# Altium project PCB_Project_EPM.PrjPcb
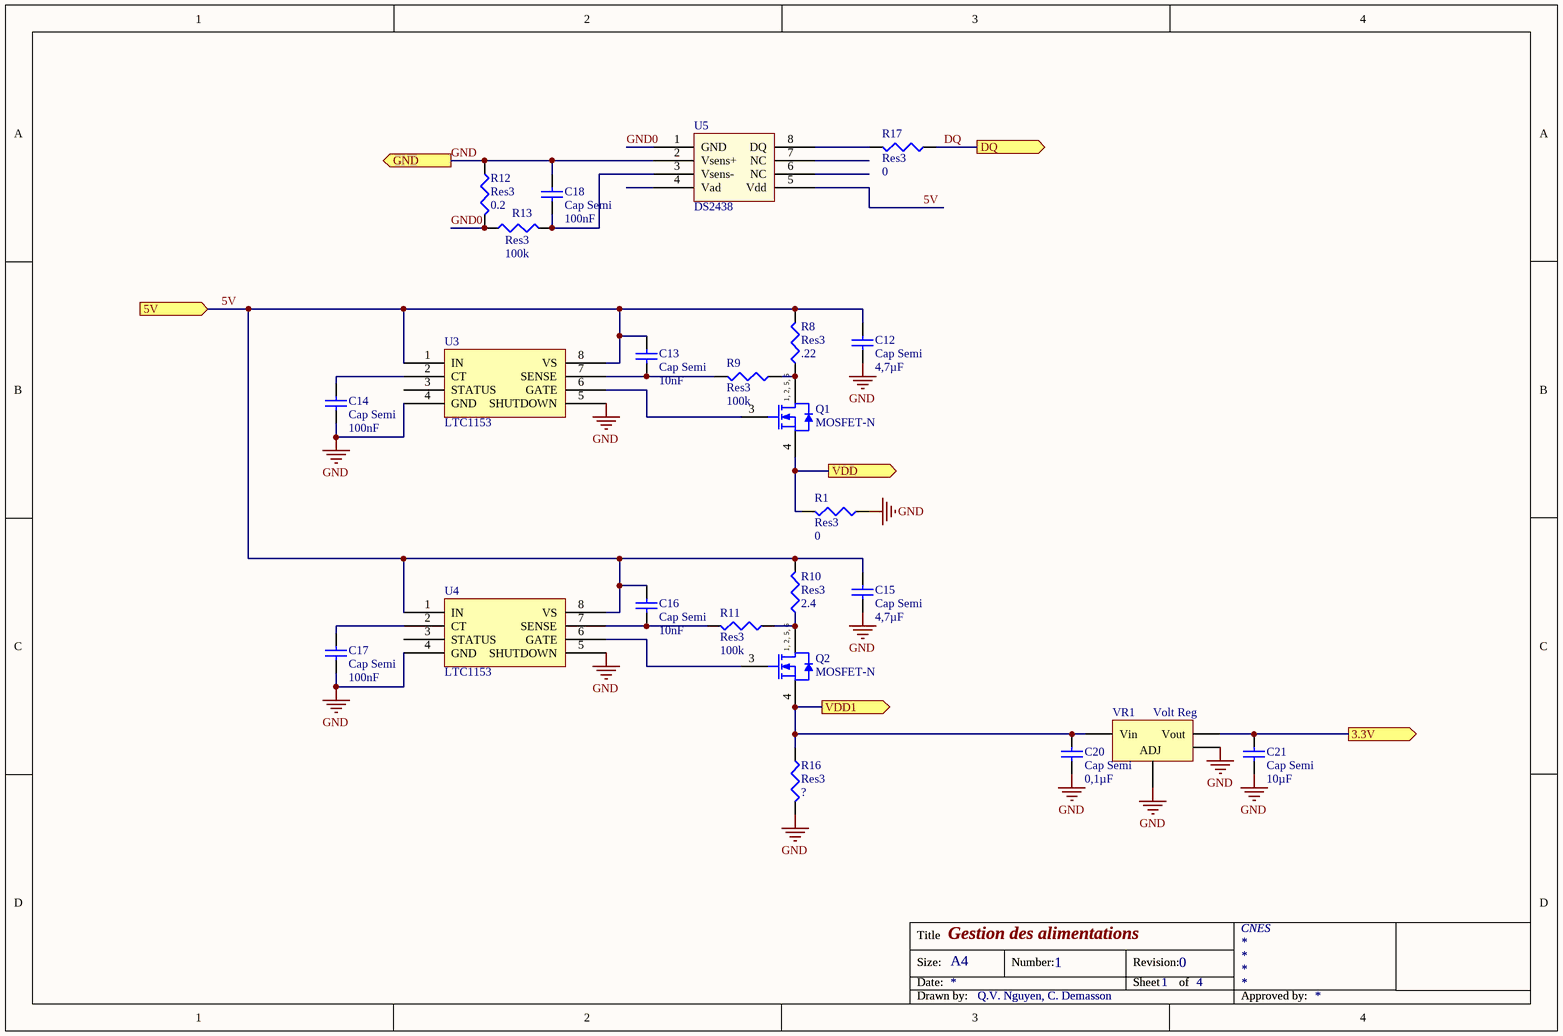
[diagram p0: sch_alim.SchDoc]
4 sheets, 53 parts. Net scope: hierarchical (ports join the sheet entries above them; power ports are global).
Board file: PCB_EPM.PcbDoc
Sheets:
  sch_alim.SchDoc
  sch_epm.SchDoc
    Pilote du Moteur = sch_driver.SchDoc
    Microcontrôleur PSoC 4 = sch_psoc.SchDoc

## Sheet sch_alim.SchDoc: Gestion des alimentations
size A4; CheckedBy: Q.V. Nguyen; Author: Q.V. Nguyen, C. Demasson; DrawnBy: Q.V. Nguyen, C. Demasson; Organization: CNES; DocumentNumber: 1; Revision: 0; SheetNumber: 1; SheetTotal: 4

### Parts
C12  Cap Semi  value 4,7µF  [C1206]
C13  Cap Semi  value 10nF  [C1206]
C14  Cap Semi  value 100nF  [C1206]
C15  Cap Semi  value 4,7µF  [C1206]
C16  Cap Semi  value 10nF  [C1206]
C17  Cap Semi  value 100nF  [C1206]
C18  Cap Semi  value 100nF  [C1206]
C20  Cap Semi  value 0,1µF  [C1206]
C21  Cap Semi  value 10µF  [C1206]
Q1  MOSFET-N  [ONSC-SC70-6-419B-02_V]
Q2  MOSFET-N  [ONSC-SC70-6-419B-02_V]
R1  Res3  value 0  [C1206]
R8  Res3  value .22  [C1206]
R9  Res3  value 100k  [C1206]
R10  Res3  value 2.4  [C1206]
R11  Res3  value 100k  [C1206]
R12  Res3  value 0.2  [C1206]
R13  Res3  value 100k  [C1206]
R16  Res3  [C1206]
R17  Res3  value 0  [C1206]
U3  LTC1153  [S8 Package]
U4  LTC1153  [S8 Package]
U5  DS2438  [SO8_N]
VR1  Volt Reg  [Reg_LM317]

### Ports
3.3V (out), 5V (in), DQ (out), GND (out), VDD1 (out), VDD (out)

### Nets
GND: C12.2 C14.2 C15.2 C17.2 C18.1 C20.2 C21.2 R1.1 R12.1 R16.2 U3.4(GND) U3.5(SHUTDOWN) U4.4(GND) U4.5(SHUTDOWN) U5.2(Vsens+) VR1.2(ADJ) VR1.4(Vout) ; port GND
5V: C12.1 C13.1 C15.1 C16.1 R8.2 R10.2 U3.1(IN) U3.8(VS) U4.1(IN) U4.8(VS) U5.5(Vdd) ; port 5V
DQ: R17.1 ; port DQ
GND0: R12.2 R13.1 U5.1(GND)
NetC13_2: C13.2 R9.2 U3.7(SENSE)
NetC14_1: C14.1 U3.2(CT)
NetC16_2: C16.2 R11.2 U4.7(SENSE)
NetC17_1: C17.1 U4.2(CT)
NetC18_2: C18.2 R13.2 U5.3(Vsens-)
NetC20_1: C20.1 Q2.4(S) R16.1 VR1.1(Vin) ; port VDD1
NetC21_1: C21.1 VR1.3(Vout) ; port 3.3V
NetQ1_1: Q1.1(D) Q1.2(D) Q1.5(D) Q1.6(D) R8.1 R9.1
NetQ1_3: Q1.3(G) U3.6(GATE)
NetQ1_4: Q1.4(S) R1.2 ; port VDD
NetQ2_1: Q2.1(D) Q2.2(D) Q2.5(D) Q2.6(D) R10.1 R11.1
NetQ2_3: Q2.3(G) U4.6(GATE)
NetR17_2: R17.2 U5.8(DQ)

Not connected (* = marked no-connect by the designer): U3 3(STATUS); U4 3(STATUS); U5 4(Vad) 6(NC) 7(NC)

### Notes on the sheet
- Title
- Size:
- Date:
- A4
- Number:
- Revision:
- Sheet
- of
- Drawn by:
- Approved by:
- (in symbol CMP-1058-00626-1) 1, 2, 5, 6

### Library data of the parts
C12-C18 C20 C21 = Cap Semi: Capacitor (Semiconductor SIM Model); Published: 8-Jun-2000; LatestRevisionDate: 29-May-2009; LatestRevisionNote: IPC-7351 Footprint Added.; PackageReference: C1206; Publisher: Altium Limited; PackageDescription: Chip Capacitor
Q1 Q2 = CMP-1058-00626-1: Trench Power MOSFET, 20 V, 4 A, Single N-Channel, 6-Pin SC70, Pb-Free, Tape and Reel; PartNumber: NTJS3157NT2G; Manufacturer: On Semiconductor; Qrr Typ (nC): 5; Channel Polarity: N Channel; Crss Typ (pF): 60; VGS Max (V): 8; V(BR)DSS Min (V): 20; Ciss Typ (pF): 500; Coss Typ (pF): 75; ID Max (A): 4; PD Max (W): 1; ComponentLink2Description: Datasheet; ComponentLink1URL: http://www.onsemi.com/; ComponentLink3Description: Package Specification; PackageVersion: Rev. Y, 12/2012; ComponentLink1Description: Manufacturer URL; RoHS: Pb-Free; PackageReference: SC70-6-419B-02; Mounting Technology: Surface Mount; Packing: Tape and Reel; DatasheetVersion: Rev. 3; PackageDescription: 6-Pin Small Outline Transistor, Body 2 x 1.25 mm, Pitch 0.65 mm; ComponentLink3URL: http://www.onsemi.com/pub_link/Collateral/419B-02.PDF; Package Type: SC-88-6 / SC-70-6 / SOT-363-6; Configuration: Single; VGS(th) Max (V): 1; ComponentLink2URL: http://www.onsemi.com/pub_link/Collateral/NTJS3157N-D.PDF
R1 R8-R13 R16 R17 = Res3: Resistor; Published: 8-Jun-2000; LatestRevisionDate: 29-May-2009; LatestRevisionNote: IPC-7351 Footprint Added.; PackageReference: J1-0603; Publisher: Altium Limited; PackageDescription: Chip Resistor
  R16: Value: ?
U5 = DS2438: Battery Monitor
VR1 = Volt Reg: Voltage Regulator; Published: 24-Mar-1999; LatestRevisionDate: 29-May-2009; LatestRevisionNote: IPC-7351 Footprint Added.; PackageReference: D2PAK; Publisher: Altium Limited; PackageDescription: 3-Pin Transistor Outline Package 2.54 mm Pitch, 15.1 mm Lead Span

## Sheet sch_epm.SchDoc: Electronique de Pilotage du Moteur
size A4; CheckedBy: Q.V. Nguyen; Author: Q.V. Nguyen, C. Demasson; DrawnBy: Q.V. Nguyen, C. Demasson; Organization: CNES; DocumentNumber: 1; Revision: 0; SheetNumber: 1; SheetTotal: 4
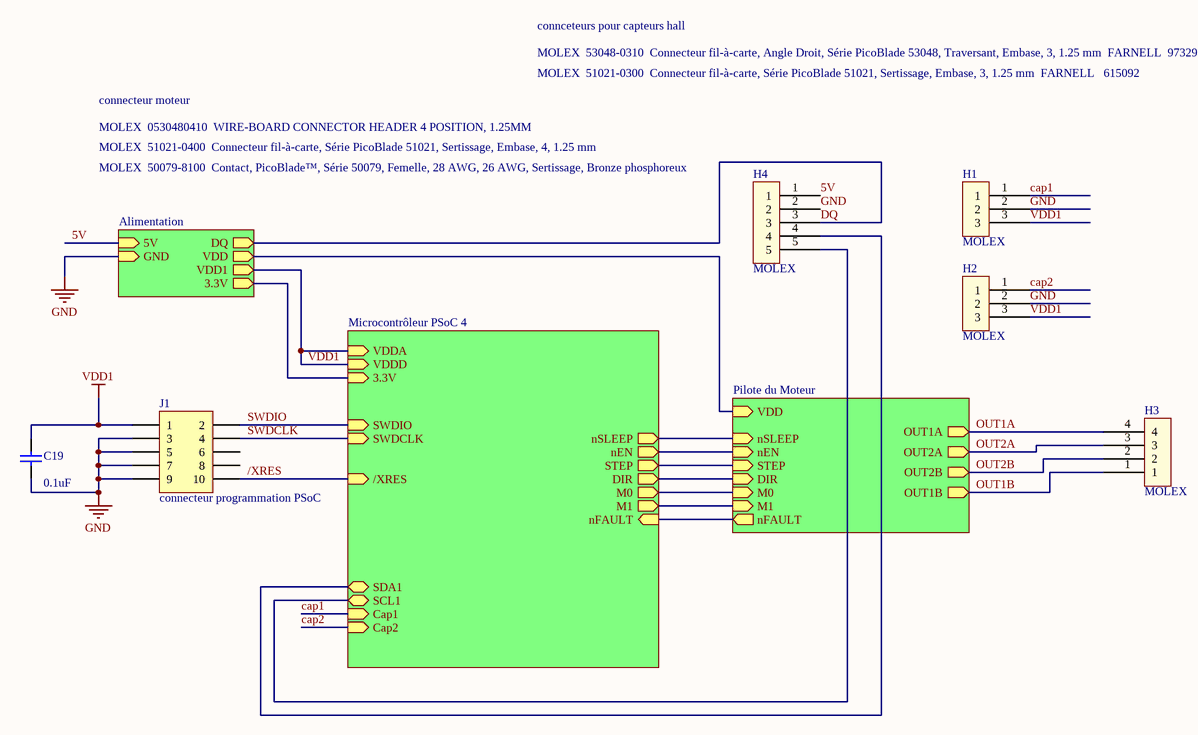
[diagram p1: sch_epm.SchDoc]

### Parts
C19  value 0.1uF  [C1206]
H1  MOLEX  [molex_male_3_broches]
H2  MOLEX  [molex_male_3_broches]
H3  MOLEX  [molex_male_4_broches]
H4  MOLEX  [molex_male_5_broches]
J1  connecteur programmation PSoC  [50MIL_KEYED_SMD]

### Sub-sheets
Alimentation = sch_alim2.0.SchDoc (file not in this document): 5V (in), DQ (out), GND (in), VDD (out), VDD1 (out), 3.3V (out)
Microcontrôleur PSoC 4 = sch_psoc.SchDoc: SWDIO (in), SWDCLK (in), /XRES (in), Cap1 (in), Cap2 (in), M0 (out), DIR (out), STEP (out), nEN (out), nSLEEP (out), nFAULT (in), M1 (out), VDDA (in), VDDD (in), 3.3V (in), SDA1, SCL1
Pilote du Moteur = sch_driver.SchDoc: OUT1A (out), OUT2A (out), OUT2B (out), VDD (in), nSLEEP (in), nEN (in), STEP (in), DIR (in), M0 (in), M1 (in), nFAULT (out), OUT1B (out)

### Nets
GND: C19.1 H1.2 H2.2 H4.2 J1.3 J1.5 J1.7 J1.9 ; sheet Alimentation/GND
VDD1: C19.2 H1.3 H2.3 J1.1 ; sheet Alimentation/VDD1, sheet Microcontrôleur PSoC 4/VDDA, sheet Microcontrôleur PSoC 4/VDDD
3.3V: sheet Alimentation/3.3V, sheet Microcontrôleur PSoC 4/3.3V
5V: H4.1 ; sheet Alimentation/5V
/XRES: J1.10 ; sheet Microcontrôleur PSoC 4//XRES
cap1: H1.1 ; sheet Microcontrôleur PSoC 4/Cap1
cap2: H2.1 ; sheet Microcontrôleur PSoC 4/Cap2
DIR: sheet Pilote du Moteur/DIR, sheet Microcontrôleur PSoC 4/DIR
DQ: H4.3 ; sheet Alimentation/DQ
M0: sheet Pilote du Moteur/M0, sheet Microcontrôleur PSoC 4/M0
M1: sheet Pilote du Moteur/M1, sheet Microcontrôleur PSoC 4/M1
nEN: sheet Pilote du Moteur/nEN, sheet Microcontrôleur PSoC 4/nEN
nFAULT: sheet Pilote du Moteur/nFAULT, sheet Microcontrôleur PSoC 4/nFAULT
nSLEEP: sheet Pilote du Moteur/nSLEEP, sheet Microcontrôleur PSoC 4/nSLEEP
OUT1A: H3.4 ; sheet Pilote du Moteur/OUT1A
OUT1B: H3.1 ; sheet Pilote du Moteur/OUT1B
OUT2A: H3.3 ; sheet Pilote du Moteur/OUT2A
OUT2B: H3.2 ; sheet Pilote du Moteur/OUT2B
SCL1: H4.5 ; sheet Microcontrôleur PSoC 4/SCL1
SDA1: H4.4 ; sheet Microcontrôleur PSoC 4/SDA1
STEP: sheet Pilote du Moteur/STEP, sheet Microcontrôleur PSoC 4/STEP
SWDCLK: J1.4 ; sheet Microcontrôleur PSoC 4/SWDCLK
SWDIO: J1.2 ; sheet Microcontrôleur PSoC 4/SWDIO
VDD: sheet Pilote du Moteur/VDD, sheet Alimentation/VDD

Not connected (* = marked no-connect by the designer): J1 6 8

### Notes on the sheet
- MOLEX  53048-0310  Connecteur fil-à-carte, Angle Droit, Série PicoBlade 53048, Traversant, Embase, 3, 1.25 mm  FARNELL  9732918
- MOLEX  51021-0300  Connecteur fil-à-carte, Série PicoBlade 51021, Sertissage, Embase, 3, 1.25 mm  FARNELL   615092
- connceteurs pour capteurs hall
- MOLEX  0530480410  WIRE-BOARD CONNECTOR HEADER 4 POSITION, 1.25MM
- connecteur moteur
- MOLEX  51021-0400  Connecteur fil-à-carte, Série PicoBlade 51021, Sertissage, Embase, 4, 1.25 mm
- (near H4) MOLEX  50079-8100  Contact, PicoBlade™, Série 50079, Femelle, 28 AWG, 26 AWG, Sertissage, Bronze phosphoreux
- Title
- Size:
- Date:
- A4
- Number:
- Revision:
- Sheet
- of
- Drawn by:
- Approved by:

### Library data of the parts
C19 = Cap Semi: Capacitor (Semiconductor SIM Model); Published: 8-Jun-2000; LatestRevisionDate: 29-May-2009; LatestRevisionNote: IPC-7351 Footprint Added.; PackageReference: C1206; Publisher: Altium Limited; PackageDescription: Chip Capacitor
H1 H2 = Molex Male 3 broches: MOLEX-53048-0510_FARNELL_9732918
H3 = Molex Male 4 broches_1: MOLEX-53048-0510_FARNELL_2064326
H4 = Molex Male 5 broches: MOLEX-53048-0510_FARNELL_2064326
J1 = Header 5X2: Header, 5-Pin, Dual row; LatestRevisionDate: 17-Jul-2002; LatestRevisionNote: Re-released for DXP Platform.; Publisher: Altium Limited

## Sheet sch_driver.SchDoc: Pilote du Moteur
size A4; CheckedBy: Q.V. Nguyen; Author: Q.V. Nguyen, C. Demasson; DrawnBy: Q.V. Nguyen, C. Demasson; Organization: CNES; DocumentNumber: 1; Revision: 0; SheetNumber: 4; SheetTotal: 4; ProjectName: EYE-SAT
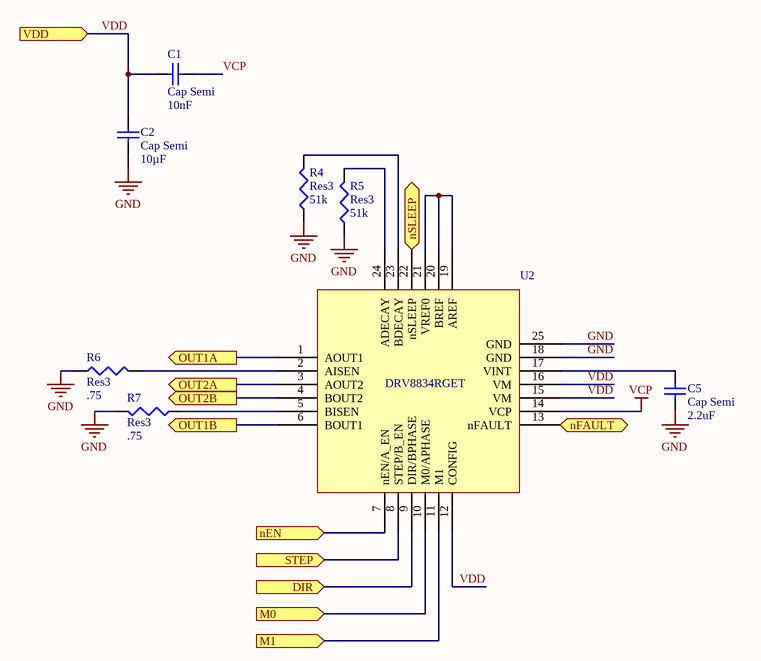
[diagram p2: sch_driver.SchDoc]

### Parts
C1  Cap Semi  value 10nF  [C1206]
C2  Cap Semi  value 10µF  [C1206]
C5  Cap Semi  value 2.2uF  [C1206]
R4  Res3  value 51k  [C1206]
R5  Res3  value 51k  [C1206]
R6  Res3  value .75  [C1206]
R7  Res3  value .75  [C1206]
U2  DRV8834RGET  [QFN24]

### Ports
DIR (in), M0 (in), M1 (in), nEN (in), nFAULT (out), nSLEEP (in), OUT1A (out), OUT1B (out), OUT2A (out), OUT2B (out), STEP (in), VDD (in)

### Nets
GND: C2.2 C5.1 R4.1 R5.1 R6.1 R7.2 U2.18(GND) U2.25(GND)
VCP: C1.1 U2.14(VCP)
DIR: U2.9(DIR/BPHASE) ; port DIR
M0: U2.10(M0/APHASE) ; port M0
M1: U2.11(M1) ; port M1
nEN: U2.7(nEN/A_EN) ; port nEN
nFAULT: U2.13(nFAULT) ; port nFAULT
nSLEEP: U2.22(nSLEEP) ; port nSLEEP
OUT1A: U2.1(AOUT1) ; port OUT1A
OUT1B: U2.6(BOUT1) ; port OUT1B
OUT2A: U2.3(AOUT2) ; port OUT2A
OUT2B: U2.4(BOUT2) ; port OUT2B
STEP: U2.8(STEP/B_EN) ; port STEP
VDD: C1.2 C2.1 U2.12(CONFIG) U2.15(VM) U2.16(VM) ; port VDD
NetC5_2: C5.2 U2.17(VINT)
NetR4_2: R4.2 U2.23(BDECAY)
NetR5_2: R5.2 U2.24(ADECAY)
NetR6_2: R6.2 U2.2(AISEN)
NetR7_1: R7.1 U2.5(BISEN)
NetU2_19: U2.19(AREF) U2.20(BREF) U2.21(VREF0)

### Notes on the sheet
- Title
- Size:
- Date:
- A4
- Number:
- Revision:
- Sheet
- of
- Drawn by:
- Approved by:

### Library data of the parts
C1 C2 C5 = Cap Semi: Capacitor (Semiconductor SIM Model); Published: 8-Jun-2000; LatestRevisionDate: 29-May-2009; LatestRevisionNote: IPC-7351 Footprint Added.; PackageReference: C1206; Publisher: Altium Limited; PackageDescription: Chip Capacitor
R4-R7 = Res3: Resistor; Published: 8-Jun-2000; LatestRevisionDate: 29-May-2009; LatestRevisionNote: IPC-7351 Footprint Added.; PackageReference: J1-0603; Publisher: Altium Limited; PackageDescription: Chip Resistor

## Sheet sch_psoc.SchDoc: Microcontrôleur PSoC 4
size A4; CheckedBy: Q.V. Nguyen; Author: Q.V. Nguyen, C. Demasson; DrawnBy: Q.V. Nguyen, C. Demasson; Organization: CNES; Revision: 0; SheetNumber: 3; SheetTotal: 4; ProjectName: EYE-SAT
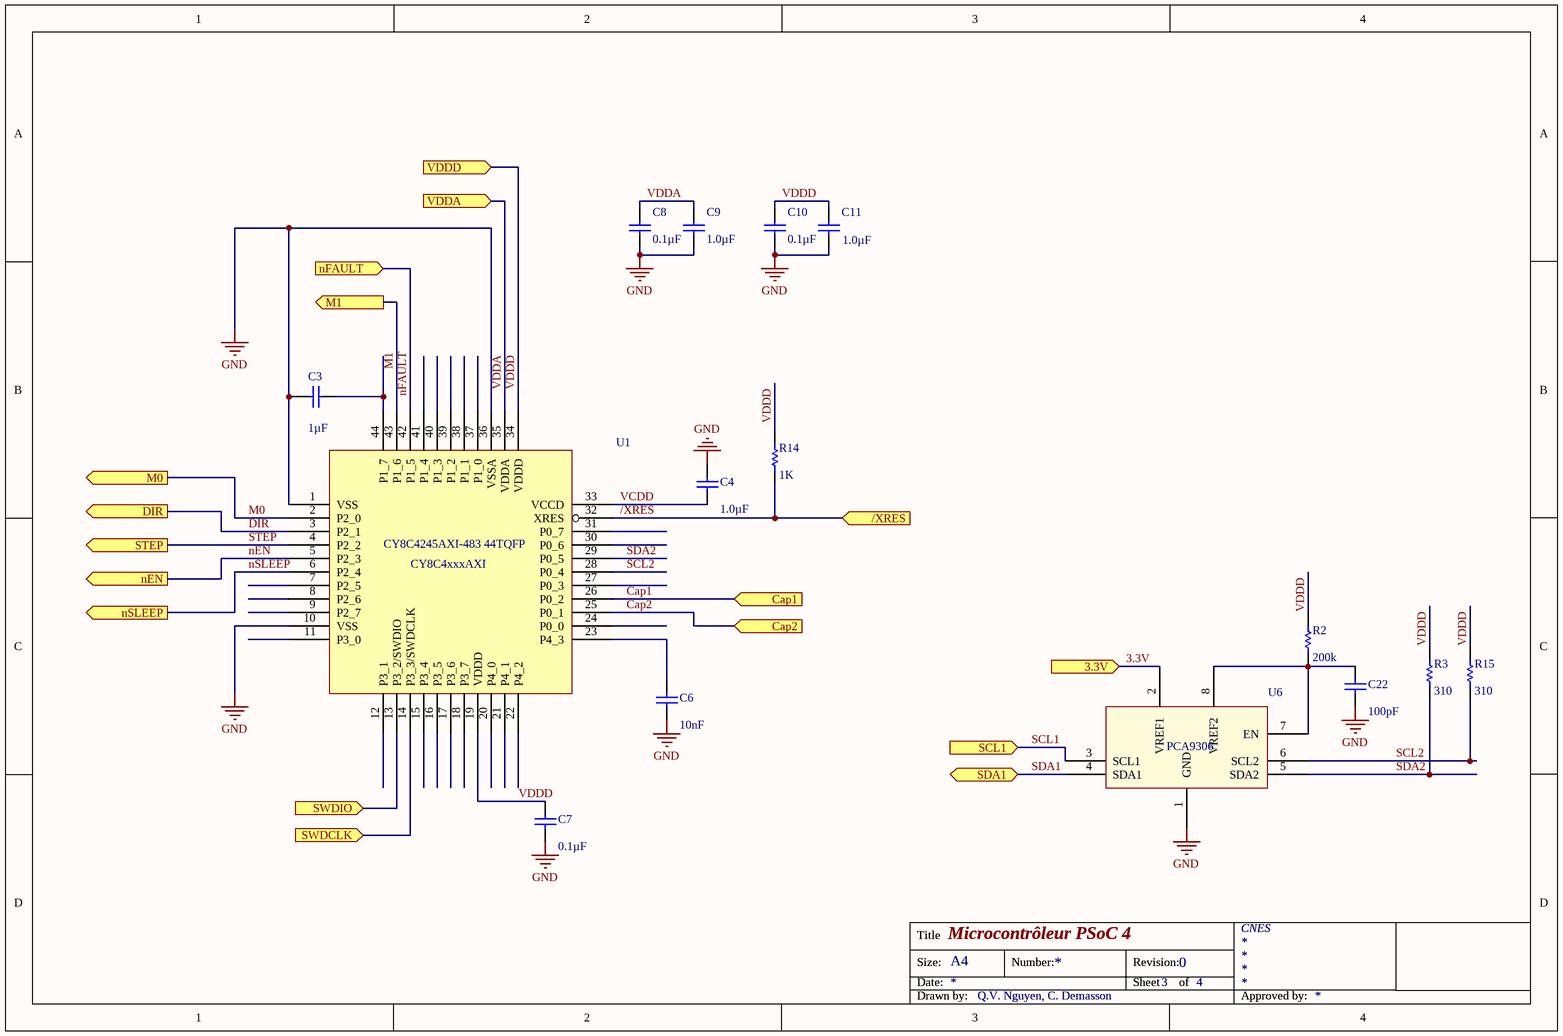
[diagram p3: sch_psoc.SchDoc]

### Parts
C3  value 1µF  [C1206]
C4  value 1.0µF  [C1206]
C6  value 10nF  [C1206]
C7  value 0.1µF  [C1206]
C8  value 0.1µF  [C1206]
C9  value 1.0µF  [C1206]
C10  value 0.1µF  [C1206]
C11  value 1.0µF  [C1206]
C22  value 100pF  [C1206]
R2  value 200k  [C1206]  (hidden comment: R2)
R3  value 310  [C1206]
R14  value 1K  [C1206]
R15  value 310  [C1206]
U1  CY8C4245AXI-483 44TQFP  [CY8C4xxxAXI]
U6  PCA9306  [VSSOP8]

### Ports
3.3V (in), /XRES (in), Cap1 (in), Cap2 (in), DIR (out), M0 (out), M1 (out), nEN (out), nFAULT (in), nSLEEP (out), SCL1 (in), SDA1 (bidir), STEP (out), SWDCLK (in), SWDIO (in), VDDA (in), VDDD (in)

### Nets
GND: C3.2 C4.1 C6.1 C7.1 C8.1 C9.1 C10.1 C11.1 C22.1 U1.1(VSS) U1.10(VSS) U1.36(VSSA) U6.1(GND)
VDDA: C7.2 C8.2 C9.2 C10.2 C11.2 R2.2 R3.2 R14.2 R15.2 U1.19(VDDD) U1.34(VDDD) U1.35(VDDA) ; port VDDA, port VDDD  [also labelled VDDD]  [project net VDD1]
3.3V: U6.2(VREF1) ; port 3.3V
/XRES: R14.1 U1.32(XRES) ; port /XRES
cap1: U1.26(P0_2) ; port Cap1
cap2: U1.25(P0_1) ; port Cap2
DIR: U1.3(P2_1) ; port DIR
M0: U1.2(P2_0) ; port M0
M1: U1.43(P1_6) ; port M1
nEN: U1.5(P2_3) ; port nEN
nFAULT: U1.42(P1_5) ; port nFAULT
nSLEEP: U1.6(P2_4) ; port nSLEEP
SCL1: U6.3(SCL1) ; port SCL1
SCL2: R15.1 U1.28(P0_4) U6.6(SCL2)
SDA1: U6.4(SDA1) ; port SDA1
SDA2: R3.1 U1.29(P0_5) U6.5(SDA2)
STEP: U1.4(P2_2) ; port STEP
SWDCLK: U1.14(P3_3/SWDCLK) ; port SWDCLK
SWDIO: U1.13(P3_2/SWDIO) ; port SWDIO
VCDD: C4.2 U1.33(VCCD)
NetC3_1: C3.1 U1.44(P1_7)
NetC6_2: C6.2 U1.23(P4_3)
NetC22_2: C22.2 R2.1 U6.7(EN) U6.8(VREF2)

Not connected (* = marked no-connect by the designer): U1 7(P2_5) 8(P2_6) 9(P2_7) 11(P3_0) 12(P3_1) 15(P3_4) 16(P3_5) 17(P3_6) 18(P3_7) 20(P4_0) 21(P4_1) 22(P4_2) 24(P0_0) 27(P0_3) 30(P0_6) 31(P0_7) 37(P1_0) 38(P1_1) 39(P1_2) 40(P1_3) 41(P1_4)

### Notes on the sheet
- Title
- Size:
- Date:
- A4
- Number:
- Revision:
- Sheet
- of
- Drawn by:
- Approved by:

### Library data of the parts
C3 C4 C6-C11 C22 = Cap Semi: Capacitor (Semiconductor SIM Model); Published: 8-Jun-2000; LatestRevisionDate: 29-May-2009; LatestRevisionNote: IPC-7351 Footprint Added.; PackageReference: C1206; Publisher: Altium Limited; PackageDescription: Chip Capacitor
R2 R3 R14 R15 = Res1: Resistor; Published: 8-Jun-2000; LatestRevisionDate: 17-Jul-2002; LatestRevisionNote: Re-released for DXP Platform.; PackageReference: AXIAL-0.3; Publisher: Altium Limited; PackageDescription: Axial Device, Thru-Hole; 2 Leads; 0.3 in Pin Spacing
U1 = CY8C4xxxAXI

## Nets that join several sheets
GND: sch_alim (17 pins), sch_epm (8 pins), sch_driver (8 pins), sch_psoc (13 pins)
VDD1: sch_epm (C19.2 H1.3 H2.3 J1.1), sch_psoc (12 pins)
/XRES: sch_epm (J1.10), sch_psoc (R14.1 U1.32)
cap1: sch_epm (H1.1), sch_psoc (U1.26)
cap2: sch_epm (H2.1), sch_psoc (U1.25)
DIR: sch_driver (U2.9), sch_psoc (U1.3)
M0: sch_driver (U2.10), sch_psoc (U1.2)
M1: sch_driver (U2.11), sch_psoc (U1.43)
nEN: sch_driver (U2.7), sch_psoc (U1.5)
nFAULT: sch_driver (U2.13), sch_psoc (U1.42)
nSLEEP: sch_driver (U2.22), sch_psoc (U1.6)
OUT1A: sch_epm (H3.4), sch_driver (U2.1)
OUT1B: sch_epm (H3.1), sch_driver (U2.6)
OUT2A: sch_epm (H3.3), sch_driver (U2.3)
OUT2B: sch_epm (H3.2), sch_driver (U2.4)
SCL1: sch_epm (H4.5), sch_psoc (U6.3)
SDA1: sch_epm (H4.4), sch_psoc (U6.4)
STEP: sch_driver (U2.8), sch_psoc (U1.4)
SWDCLK: sch_epm (J1.4), sch_psoc (U1.14)
SWDIO: sch_epm (J1.2), sch_psoc (U1.13)